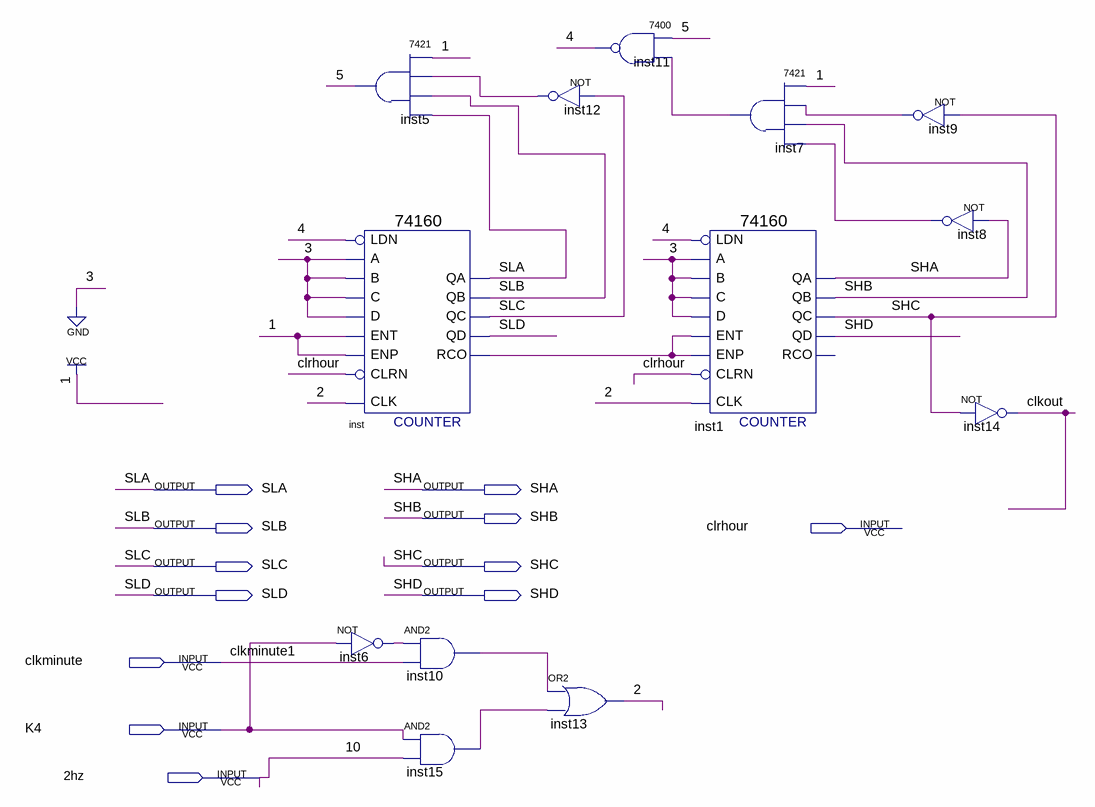
[diagram p0: schematic sheet]
// Quartus schematic hour.bdf as structural Verilog: 13 symbols, 12 pins
module hour (
  input  clrhour,
  input  clkminute,
  input  K4,
  input  \2hz ,
  output SLA,
  output SHA,
  output SHB,
  output SLB,
  output SLC,
  output SHC,
  output SLD,
  output SHD
);

  wire \2 , \4 , \5 , clkout, inst6_out, inst7_1, inst8_out, inst9_out, inst10_out, inst12_out, inst15_out,
       inst_rco;

  \74160  inst (
    .CLK(\2 ), .ENT(1'b1), .A(1'b0), .B(1'b0), .C(1'b0), .D(1'b0), .LDN(\4 ), .ENP(1'b1), .CLRN(clrhour),
    .QD(SLD), .QA(SLA), .QB(SLB), .QC(SLC), .RCO(inst_rco));
  not inst6 (inst6_out, K4);
  \7421  inst5 (.\5 (SLA), .\4 (SLB), .\3 (inst12_out), .\2 (1'b1), .\1 (\5 ));
  and inst10 (inst10_out, inst6_out, clkminute);
  and inst15 (inst15_out, K4, \2hz );
  not inst12 (inst12_out, SLC);
  or inst13 (\2 , inst10_out, inst15_out);
  \7400  inst11 (.\3 (inst7_1), .\2 (\5 ), .\1 (\4 ));
  \7421  inst7 (.\5 (inst8_out), .\4 (SHB), .\3 (inst9_out), .\2 (1'b1), .\1 (inst7_1));
  \74160  inst1 (
    .CLK(\2 ), .ENT(inst_rco), .A(1'b0), .B(1'b0), .C(1'b0), .D(1'b0), .LDN(\4 ), .ENP(inst_rco),
    .CLRN(clrhour), .QD(SHD), .QA(SHA), .QB(SHB), .QC(SHC));  // open: RCO
  not inst9 (inst9_out, SHC);
  not inst8 (inst8_out, SHA);
  not inst14 (clkout, SHC);

  // Other names for the same wires on the sheet: 10 = \2hz ; clkminute1 = clkminute
endmodule
